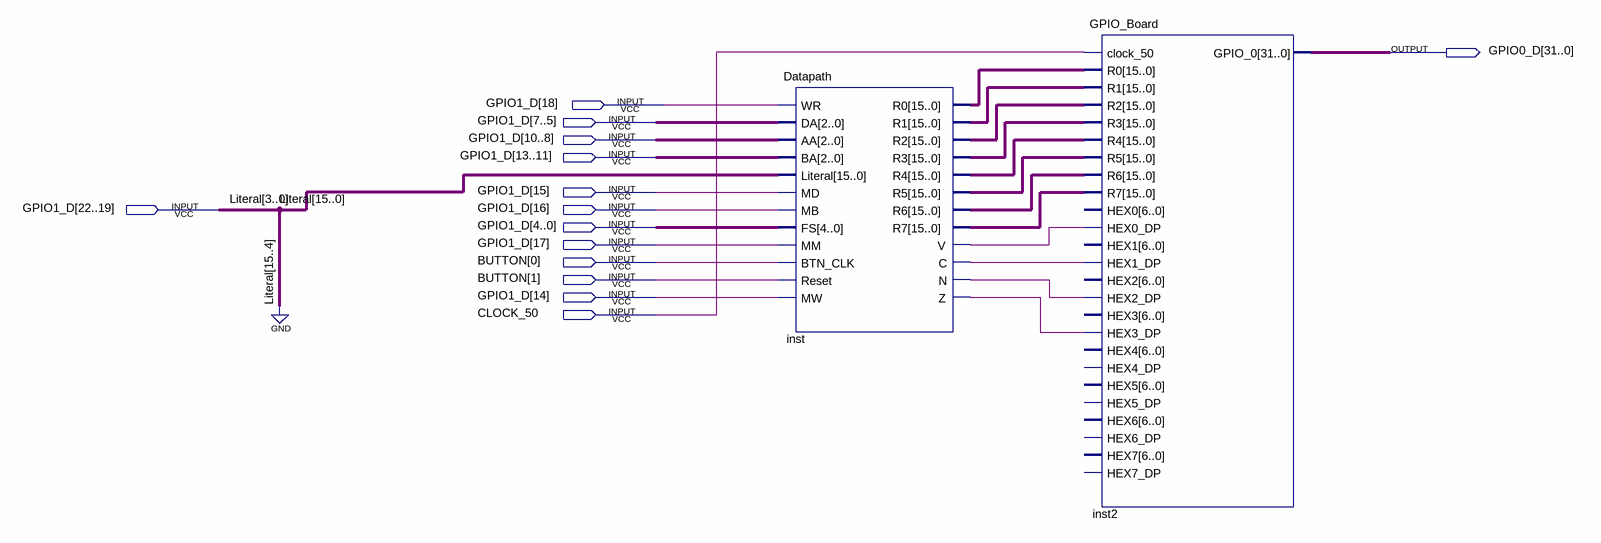
[diagram p0: schematic sheet]
// Quartus schematic Datapath_test.bdf as structural Verilog: 2 symbols, 14 pins
module Datapath_test (
  input  [22:0] GPIO1_D,
  input  [1:0] BUTTON,
  input  CLOCK_50,
  output [31:0] GPIO0_D
);

  wire inst_c, inst_n, inst_v, inst_z;
  wire [15:0] inst_r0, inst_r1, inst_r2, inst_r3, inst_r4, inst_r5, inst_r6, inst_r7;

  Datapath inst (
    .WR(GPIO1_D[18]), .DA(GPIO1_D[7:5]), .AA(GPIO1_D[10:8]), .BA(GPIO1_D[13:11]),
    .Literal({{12{1'b0}}, GPIO1_D[22:19]}), .MD(GPIO1_D[15]), .MB(GPIO1_D[16]), .FS(GPIO1_D[4:0]),
    .MM(GPIO1_D[17]), .BTN_CLK(BUTTON[0]), .Reset(BUTTON[1]), .MW(GPIO1_D[14]), .R0(inst_r0), .R1(inst_r1),
    .R2(inst_r2), .R3(inst_r3), .R4(inst_r4), .R5(inst_r5), .R6(inst_r6), .R7(inst_r7), .V(inst_v),
    .C(inst_c), .N(inst_n), .Z(inst_z));
  GPIO_Board inst2 (
    .clock_50(CLOCK_50), .R0(inst_r0), .R1(inst_r1), .R2(inst_r2), .R3(inst_r3), .R4(inst_r4), .R5(inst_r5),
    .R6(inst_r6), .R7(inst_r7), .HEX0_DP(inst_v), .HEX1_DP(inst_c), .HEX2_DP(inst_n), .HEX3_DP(inst_z),
    .GPIO_0(GPIO0_D));  // open: HEX0, HEX1, HEX2, HEX3, HEX4, HEX4_DP, HEX5, HEX5_DP, HEX6, HEX6_DP, HEX7, HEX7_DP

  // Other names for the same wires on the sheet: Literal[3:0] = GPIO1_D[22:19]
endmodule
